# EAGLE design Quimera_Power-Input (EAGLE 7.5.0)
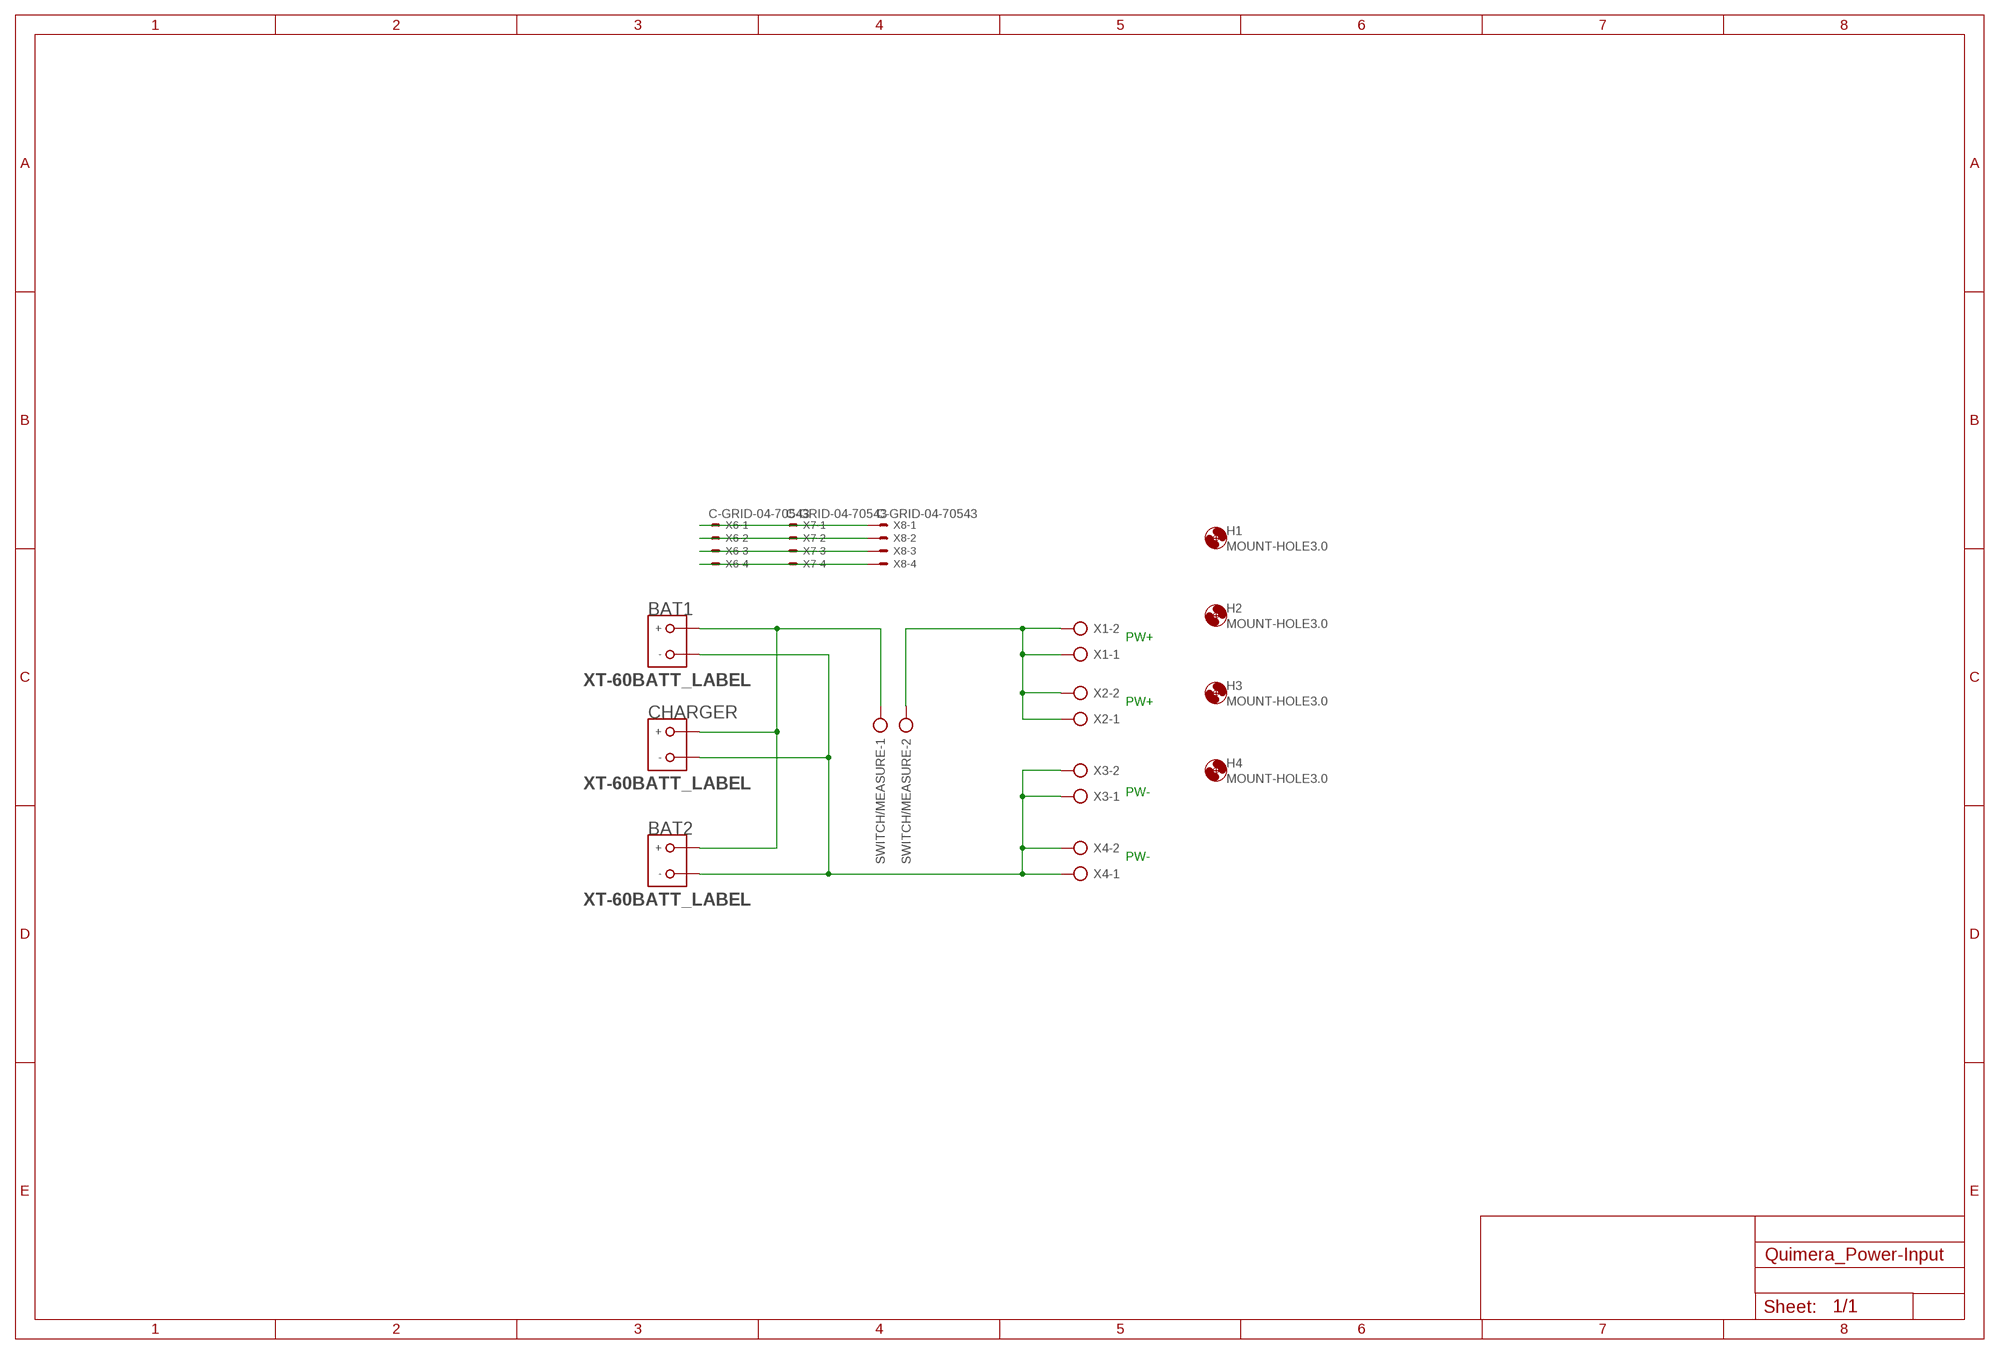
[diagram p0: schematic, sheet 1]

## Parts
BAT1  XT-60BATT_LABEL  [XT-60]
BAT2  XT-60BATT_LABEL  [XT-60]
CHARGER  XT-60BATT_LABEL  [XT-60]
H1  MOUNT-HOLE3.0  [3,0]
H2  MOUNT-HOLE3.0  [3,0]
H3  MOUNT-HOLE3.0  [3,0]
H4  MOUNT-HOLE3.0  [3,0]
SWITCH/MEASURE  AK500/2  [AK500/2]
X1  AK500/2  [AK500/2]
X2  AK500/2  [AK500/2]
X3  AK500/2  [AK500/2]
X4  AK500/2  [AK500/2]
X6  C-GRID-04-70543  [70543-04]
X7  C-GRID-04-70543  [70543-04]
X8  C-GRID-04-70543  [70543-04]

## Nets
N$1: BAT1.GND(-) BAT2.GND(-) CHARGER.GND(-) X3.1 X3.2 X4.1 X4.2
N$2: SWITCH/MEASURE.2 X1.1 X1.2 X2.1 X2.2
N$3: BAT1.BATT(+) BAT2.BATT(+) CHARGER.BATT(+) SWITCH/MEASURE.1
N$4: X6.1 X7.1 X8.1
N$5: X6.2 X7.2 X8.2
N$6: X6.3 X7.3 X8.3
N$7: X6.4 X7.4 X8.4

## Notes on the sheet
- PW+
- PW+
- PW-
- PW-

## Library data of the parts
BAT1 BAT2 CHARGER = RoboJackets-Connectors:XT-60: XT-60 Power Connector Distributor: HobbyKing <http://www.hobbyking.com/hobbyking/store/RC_PRODUCT_SEARCH.asp?strSearch=xt-60>
H1-H4 = holes:MOUNT-HOLE: MOUNTING HOLE with drill center marker
SWITCH/MEASURE X1-X4 = con-ptr500:AK500/2: CONNECTOR; OC_FARNELL: unknown; OC_NEWARK: unknown
X6-X8 = con-molex:C-GRID-04: CONNECTOR wire to board 2.54 mm (0.100") pitch header; OC_FARNELL: unknown; OC_NEWARK: unknown

## Board
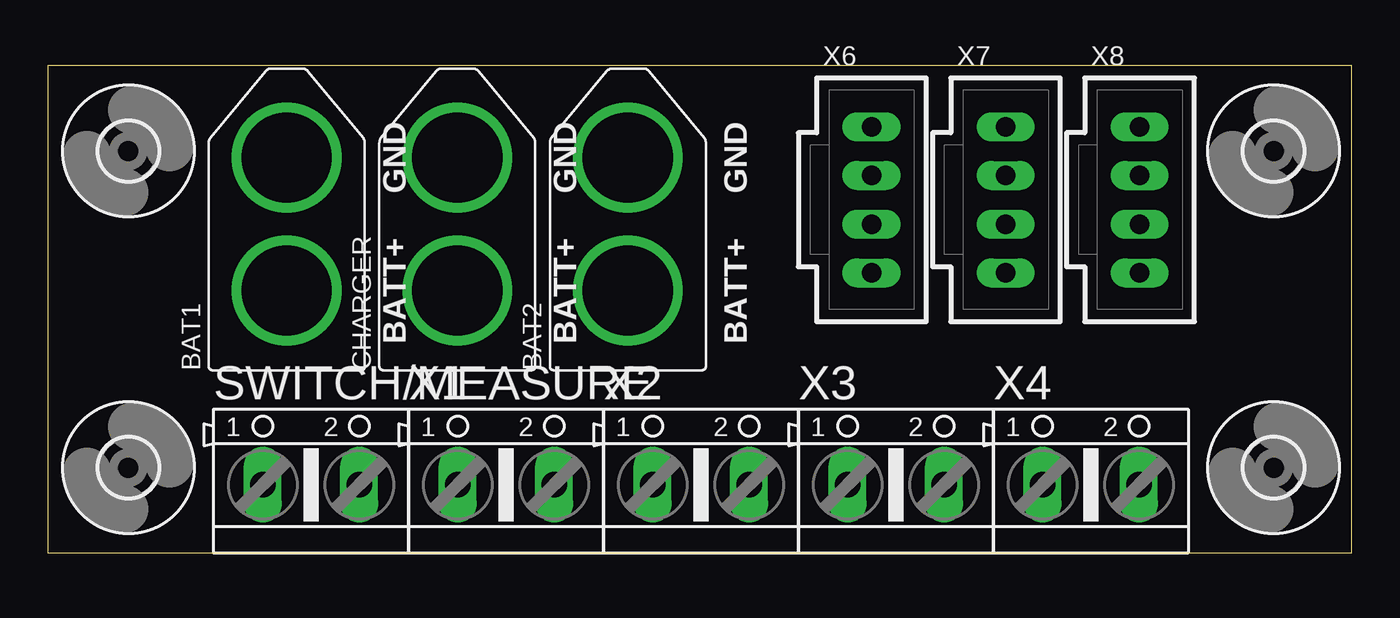
[diagram p1: board, top side]
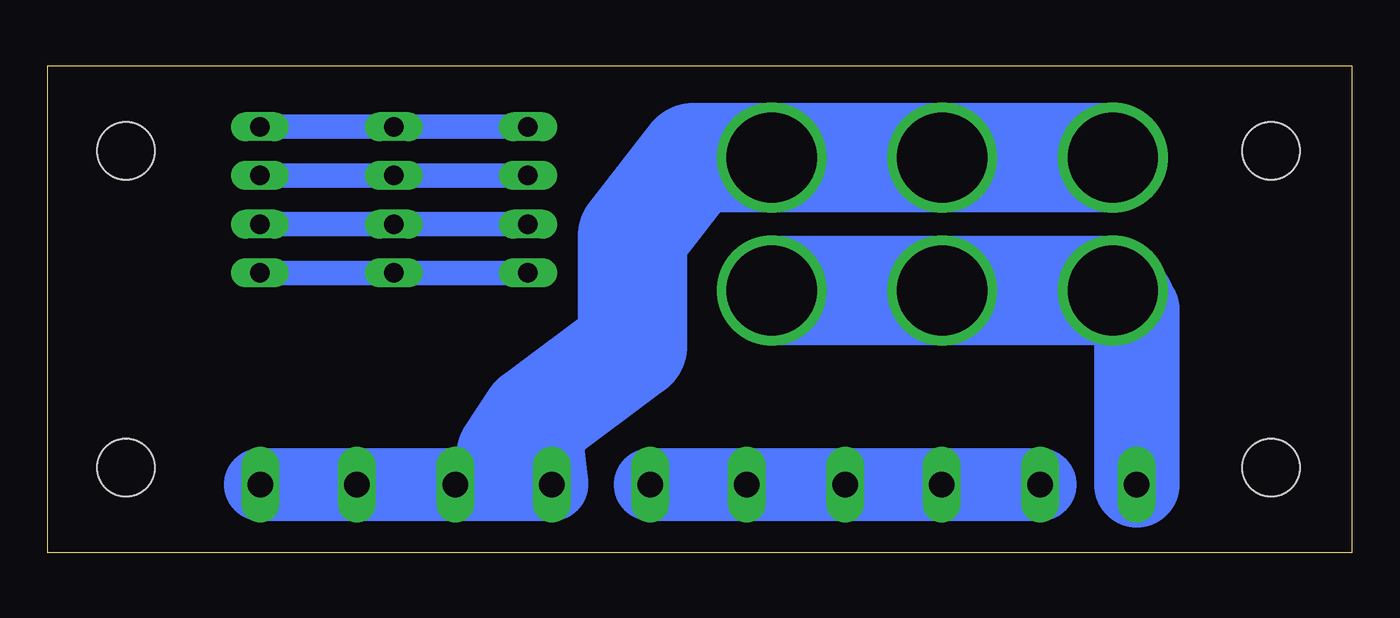
[diagram p2: board, bottom side, seen from below]

Size 67.94 x 25.4 mm. Coordinates in mm from the lower left corner, seen from the top.
Outline: 0,0 67.94,0 67.94,25.4 0,25.4 0,0
Copper layers (1*16): Top 0.035mm / dielectric 1.5mm / Bottom 0.035mm
Design rules "default": minimum track width 10mil, minimum drill 24mil, track to track 8mil, track to pad 8mil, pad to pad 8mil, via to via 8mil, smd to smd 8mil, copper to edge 40mil, drill to drill 8mil, minimum pad ring 10mil, minimum via ring 8mil, stop-mask expansion 4mil, vias tented up to drill 0mil, thermal gap 10mil

### Footprints (pad centres in the part's own frame; a part is rotated, then mirrored left to right if it is on the bottom)
XT-60 = drill 4.7: BATT 0,4.154; GND 0,11.092
3,0 = hole 3: 0,0
AK500/2 = drill 1.321 long: 1 -2.515,0; 2 2.515,0
70543-04 = drill 1.016 long: 1 -3.81,0; 2 -1.27,0; 3 1.27,0; 4 3.81,0

### Placement (x,y rotation side)
BAT1  12.45,9.53 0 top
BAT2  30.23,9.53 0 top
CHARGER  21.34,9.53 0 top
H1  4.19,4.45 0 top
H2  63.88,4.45 0 top
H3  4.19,20.95 0 top
H4  63.88,20.95 0 top
SWITCH/MEASURE  13.72,3.56 0 top
X1  23.88,3.56 0 top
X2  34.04,3.56 0 top
X3  44.2,3.56 0 top
X4  54.36,3.56 0 top
X6  42.93,18.41 270 top
X7  49.91,18.41 270 top
X8  56.9,18.41 270 top

### Tracks (layer width: path | path; a pad name or v marks a point on that pad's centre or on a via)
N$1
  Bottom 3.81: X4.2 X4.1 X3.2 X3.1 41.94,5.74 43.81,5.08
  Bottom 5.715: BAT1.GND CHARGER.GND BAT2.GND 34.29,20.62 37.47,16.51 37.47,10.79 42.55,6.99 43.81,5.08
N$2
  Bottom 3.81: SWITCH/MEASURE.2 X1.1 X1.2 X2.1 X2.2
N$3
  Bottom 4.445: SWITCH/MEASURE.1 11.2,12.7 11.72,13.04
  Bottom 5.08: 11.72,13.04 BAT1.BATT
  Bottom 5.715: BAT1.BATT CHARGER.BATT BAT2.BATT
N$4
  Bottom 1.27: X6.1 X7.1 X8.1
N$5
  Bottom 1.27: X6.2 X7.2 X8.2
N$6
  Bottom 1.27: X6.3 X7.3 X8.3
N$7
  Bottom 1.27: X6.4 X7.4 X8.4